# Altium project MotherBoard.PrjPcb (part 2 of 2)
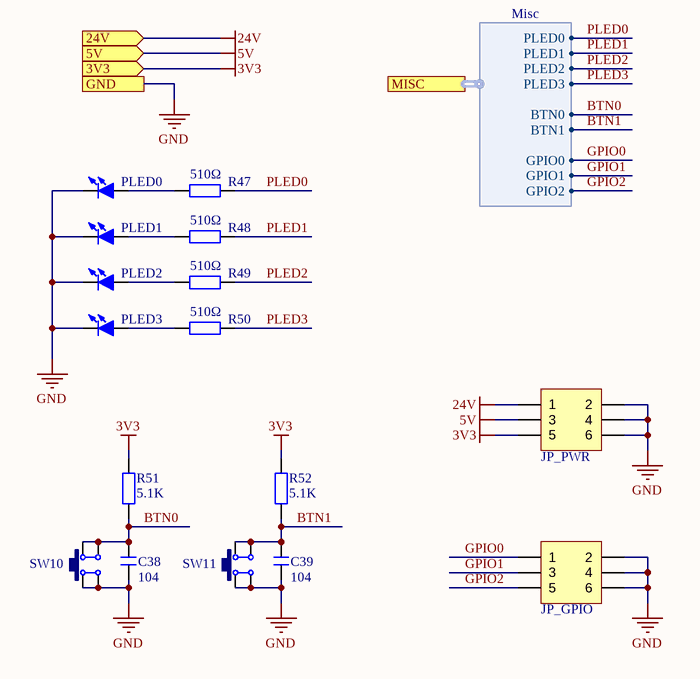
[diagram p16: Misc.SchDoc]

## Nets that join several sheets
3V3: 5V_and_3V3 (C8.1 V1.2), LowSpeedSlots_x8 (20 pins), HighSpeedSlots_x2 (6 pins), FPGA_Core (JTAG.2 R8.2 R9.2), PS_RJ45 (R12.2 R13.2), PL_PHY_RJ45 (15 pins), SD_Card (14 pins), LCD_Screen (R37.2 R38.2), Misc (JP_PWR.5 R51.2 R52.2)
5V: 5V_and_3V3 (5 pins), LowSpeedSlots_x8 (C40.2 U2.6 U2.16), HighSpeedSlots_x2 (C41.2 U5.5), FPGA_Core (8 pins), ADC_Array (7 pins), UART_TypeC (C28.2 C29.2 D5.1), LCD_Screen (C37.2 JP2.39 JP2.40), Misc (JP_PWR.3)
24V: 24V_Supply (5 pins), 5V_and_3V3 (C6.1 U1.1), U_LowSpeedSlots_x8/U_CardSlot1 (JP1_U_CardSlot1.1 JP1_U_CardSlot1.6 JP1_U_CardSlot1.16), U_LowSpeedSlots_x8/U_CardSlot2 (JP1_U_CardSlot2.1 JP1_U_CardSlot2.6 JP1_U_CardSlot2.16), U_LowSpeedSlots_x8/U_CardSlot3 (JP1_U_CardSlot3.1 JP1_U_CardSlot3.6 JP1_U_CardSlot3.16), U_LowSpeedSlots_x8/U_CardSlot4 (JP1_U_CardSlot4.1 JP1_U_CardSlot4.6 JP1_U_CardSlot4.16), U_LowSpeedSlots_x8/U_CardSlot5 (JP1_U_CardSlot5.1 JP1_U_CardSlot5.6 JP1_U_CardSlot5.16), U_LowSpeedSlots_x8/U_CardSlot6 (JP1_U_CardSlot6.1 JP1_U_CardSlot6.6 JP1_U_CardSlot6.16), U_LowSpeedSlots_x8/U_CardSlot7 (JP1_U_CardSlot7.1 JP1_U_CardSlot7.6 JP1_U_CardSlot7.16), U_LowSpeedSlots_x8/U_CardSlot8 (JP1_U_CardSlot8.1 JP1_U_CardSlot8.6 JP1_U_CardSlot8.16), U_HighSpeedSlots_x2/U_CardSlot9 (JP1_U_CardSlot9.1 JP1_U_CardSlot9.6 JP1_U_CardSlot9.16), U_HighSpeedSlots_x2/U_CardSlot10 (JP1_U_CardSlot10.1 JP1_U_CardSlot10.6 JP1_U_CardSlot10.16), Misc (JP_PWR.1)
GND: 24V_Supply (6 pins), 5V_and_3V3 (8 pins), LowSpeedSlots_x8 (18 pins), U_LowSpeedSlots_x8/U_CardSlot1 (6 pins), U_LowSpeedSlots_x8/U_CardSlot2 (6 pins), U_LowSpeedSlots_x8/U_CardSlot3 (6 pins), U_LowSpeedSlots_x8/U_CardSlot4 (6 pins), U_LowSpeedSlots_x8/U_CardSlot5 (6 pins), U_LowSpeedSlots_x8/U_CardSlot6 (6 pins), U_LowSpeedSlots_x8/U_CardSlot7 (6 pins), U_LowSpeedSlots_x8/U_CardSlot8 (6 pins), HighSpeedSlots_x2 (6 pins), U_HighSpeedSlots_x2/U_CardSlot9 (6 pins), U_HighSpeedSlots_x2/U_CardSlot10 (6 pins), FPGA_Core (29 pins), PS_RJ45 (8 pins), PL_PHY_RJ45 (27 pins), ADC_Array (58 pins), UART_TypeC (12 pins), SD_Card (12 pins), LCD_Screen (5 pins), Misc (16 pins)
AD_CLK: FPGA_Core (FPGA.J1_65), ADC_Array (R29.2 R32.2)
AD_CS0: FPGA_Core (FPGA.J1_66), ADC_Array (ADC1.1)
AD_CS1: FPGA_Core (FPGA.J1_68), ADC_Array (ADC2.1)
AD_MISO: FPGA_Core (FPGA.J1_63), ADC_Array (R30.2 R33.2)
AD_MOSI: FPGA_Core (FPGA.J1_61), ADC_Array (R31.2 R34.2)
BTN0: FPGA_Core (FPGA.J2_57), Misc (C38.2 R51.1 SW10.2 SW10.3)
BTN1: FPGA_Core (FPGA.J2_90), Misc (C39.2 R52.1 SW11.2 SW11.3)
GPIO0: FPGA_Core (FPGA.J1_47), Misc (JP_GPIO.1)
GPIO1: FPGA_Core (FPGA.J1_49), Misc (JP_GPIO.3)
GPIO2: FPGA_Core (FPGA.J1_51), Misc (JP_GPIO.5)
HAD0: U_HighSpeedSlots_x2/U_CardSlot9 (JP1_U_CardSlot9.8), U_HighSpeedSlots_x2/U_CardSlot10 (JP1_U_CardSlot10.8), FPGA_Core (FPGA.J1_86)
HAD1: U_HighSpeedSlots_x2/U_CardSlot9 (JP1_U_CardSlot9.9), U_HighSpeedSlots_x2/U_CardSlot10 (JP1_U_CardSlot10.9), FPGA_Core (FPGA.J1_84)
HAD2: U_HighSpeedSlots_x2/U_CardSlot9 (JP1_U_CardSlot9.10), U_HighSpeedSlots_x2/U_CardSlot10 (JP1_U_CardSlot10.10), FPGA_Core (FPGA.J1_82)
HAD3: HighSpeedSlots_x2 (U5.1), FPGA_Core (FPGA.J1_80)
HCLK: HighSpeedSlots_x2 (CHCLK.1), FPGA_Core (FPGA.J1_90)
HCTR: HighSpeedSlots_x2 (U5.3), FPGA_Core (FPGA.J1_74)
HDIN: HighSpeedSlots_x2 (CHDIN.1), FPGA_Core (FPGA.J1_88)
HEN9: HighSpeedSlots_x2 (U5.6), U_HighSpeedSlots_x2/U_CardSlot9 (JP1_U_CardSlot9.11)
HEN10: HighSpeedSlots_x2 (U5.4), U_HighSpeedSlots_x2/U_CardSlot10 (JP1_U_CardSlot10.11)
HSCLK9: HighSpeedSlots_x2 (CHCLK.3), U_HighSpeedSlots_x2/U_CardSlot9 (JP1_U_CardSlot9.3)
HSCLK10: HighSpeedSlots_x2 (CHCLK.8), U_HighSpeedSlots_x2/U_CardSlot10 (JP1_U_CardSlot10.3)
HSDIN9: HighSpeedSlots_x2 (CHDIN.3), U_HighSpeedSlots_x2/U_CardSlot9 (JP1_U_CardSlot9.4)
HSDIN10: HighSpeedSlots_x2 (CHDIN.8), U_HighSpeedSlots_x2/U_CardSlot10 (JP1_U_CardSlot10.4)
IIC_SCL: FPGA_Core (FPGA.J1_24), LCD_Screen (JP2.3 R38.1)
IIC_SDA: FPGA_Core (FPGA.J1_14), LCD_Screen (JP2.5 R37.1)
LAD0: U_LowSpeedSlots_x8/U_CardSlot1 (JP1_U_CardSlot1.8), U_LowSpeedSlots_x8/U_CardSlot2 (JP1_U_CardSlot2.8), U_LowSpeedSlots_x8/U_CardSlot3 (JP1_U_CardSlot3.8), U_LowSpeedSlots_x8/U_CardSlot4 (JP1_U_CardSlot4.8), U_LowSpeedSlots_x8/U_CardSlot5 (JP1_U_CardSlot5.8), U_LowSpeedSlots_x8/U_CardSlot6 (JP1_U_CardSlot6.8), U_LowSpeedSlots_x8/U_CardSlot7 (JP1_U_CardSlot7.8), U_LowSpeedSlots_x8/U_CardSlot8 (JP1_U_CardSlot8.8), FPGA_Core (FPGA.J1_73)
LAD1: U_LowSpeedSlots_x8/U_CardSlot1 (JP1_U_CardSlot1.9), U_LowSpeedSlots_x8/U_CardSlot2 (JP1_U_CardSlot2.9), U_LowSpeedSlots_x8/U_CardSlot3 (JP1_U_CardSlot3.9), U_LowSpeedSlots_x8/U_CardSlot4 (JP1_U_CardSlot4.9), U_LowSpeedSlots_x8/U_CardSlot5 (JP1_U_CardSlot5.9), U_LowSpeedSlots_x8/U_CardSlot6 (JP1_U_CardSlot6.9), U_LowSpeedSlots_x8/U_CardSlot7 (JP1_U_CardSlot7.9), U_LowSpeedSlots_x8/U_CardSlot8 (JP1_U_CardSlot8.9), FPGA_Core (FPGA.J1_75)
LAD2: U_LowSpeedSlots_x8/U_CardSlot1 (JP1_U_CardSlot1.10), U_LowSpeedSlots_x8/U_CardSlot2 (JP1_U_CardSlot2.10), U_LowSpeedSlots_x8/U_CardSlot3 (JP1_U_CardSlot3.10), U_LowSpeedSlots_x8/U_CardSlot4 (JP1_U_CardSlot4.10), U_LowSpeedSlots_x8/U_CardSlot5 (JP1_U_CardSlot5.10), U_LowSpeedSlots_x8/U_CardSlot6 (JP1_U_CardSlot6.10), U_LowSpeedSlots_x8/U_CardSlot7 (JP1_U_CardSlot7.10), U_LowSpeedSlots_x8/U_CardSlot8 (JP1_U_CardSlot8.10), FPGA_Core (FPGA.J1_77)
LAD3: LowSpeedSlots_x8 (U2.1), FPGA_Core (FPGA.J1_79)
LAD4: LowSpeedSlots_x8 (U2.2), FPGA_Core (FPGA.J1_81)
LAD5: LowSpeedSlots_x8 (U2.3), FPGA_Core (FPGA.J1_83)
LCD_B0: FPGA_Core (FPGA.J1_27), LCD_Screen (JP2.20)
LCD_B1: FPGA_Core (FPGA.J1_25), LCD_Screen (JP2.19)
LCD_B2: FPGA_Core (FPGA.J1_28), LCD_Screen (JP2.18)
LCD_B3: FPGA_Core (FPGA.J1_26), LCD_Screen (JP2.17)
LCD_B4: FPGA_Core (FPGA.J1_23), LCD_Screen (JP2.16)
LCD_B5: FPGA_Core (FPGA.J1_21), LCD_Screen (JP2.15)
LCD_B6: FPGA_Core (FPGA.J1_22), LCD_Screen (JP2.14)
LCD_B7: FPGA_Core (FPGA.J1_20), LCD_Screen (JP2.13)
LCD_BL: FPGA_Core (FPGA.J2_29), LCD_Screen (JP2.7)
LCD_CLK: FPGA_Core (FPGA.J1_18), LCD_Screen (JP2.11)
LCD_DE: FPGA_Core (FPGA.J1_11), LCD_Screen (JP2.8)
LCD_G0: FPGA_Core (FPGA.J1_35), LCD_Screen (JP2.29)
LCD_G1: FPGA_Core (FPGA.J1_33), LCD_Screen (JP2.28)
LCD_G2: FPGA_Core (FPGA.J1_38), LCD_Screen (JP2.27)
LCD_G3: FPGA_Core (FPGA.J1_36), LCD_Screen (JP2.26)
LCD_G4: FPGA_Core (FPGA.J1_31), LCD_Screen (JP2.25)
LCD_G5: FPGA_Core (FPGA.J1_29), LCD_Screen (JP2.24)
LCD_G6: FPGA_Core (FPGA.J1_32), LCD_Screen (JP2.23)
LCD_G7: FPGA_Core (FPGA.J1_30), LCD_Screen (JP2.22)
LCD_HSYNC: FPGA_Core (FPGA.J1_16), LCD_Screen (JP2.10)
LCD_R0: FPGA_Core (FPGA.J1_45), LCD_Screen (JP2.38)
LCD_R1: FPGA_Core (FPGA.J1_43), LCD_Screen (JP2.37)
LCD_R2: FPGA_Core (FPGA.J1_46), LCD_Screen (JP2.36)
LCD_R3: FPGA_Core (FPGA.J1_44), LCD_Screen (JP2.35)
LCD_R4: FPGA_Core (FPGA.J1_39), LCD_Screen (JP2.34)
LCD_R5: FPGA_Core (FPGA.J1_37), LCD_Screen (JP2.33)
LCD_R6: FPGA_Core (FPGA.J1_42), LCD_Screen (JP2.32)
LCD_R7: FPGA_Core (FPGA.J1_40), LCD_Screen (JP2.31)
LCD_RST: FPGA_Core (FPGA.J2_50), LCD_Screen (C36.1 JP2.1)
LCD_VSYNC: FPGA_Core (FPGA.J1_13), LCD_Screen (JP2.9)
LCLK: LowSpeedSlots_x8 (CFCLK1.1 CFCLK2.1), FPGA_Core (FPGA.J1_69)
LCTR: LowSpeedSlots_x8 (U2.4 U2.5), FPGA_Core (FPGA.J1_89)
LDIN: LowSpeedSlots_x8 (CFDIN1.1 CFDIN2.1), FPGA_Core (FPGA.J1_71)
LEN1: LowSpeedSlots_x8 (U2.15), U_LowSpeedSlots_x8/U_CardSlot1 (JP1_U_CardSlot1.11)
LEN2: LowSpeedSlots_x8 (U2.14), U_LowSpeedSlots_x8/U_CardSlot2 (JP1_U_CardSlot2.11)
LEN3: LowSpeedSlots_x8 (U2.13), U_LowSpeedSlots_x8/U_CardSlot3 (JP1_U_CardSlot3.11)
LEN4: LowSpeedSlots_x8 (U2.12), U_LowSpeedSlots_x8/U_CardSlot4 (JP1_U_CardSlot4.11)
LEN5: LowSpeedSlots_x8 (U2.11), U_LowSpeedSlots_x8/U_CardSlot5 (JP1_U_CardSlot5.11)
LEN6: LowSpeedSlots_x8 (U2.10), U_LowSpeedSlots_x8/U_CardSlot6 (JP1_U_CardSlot6.11)
LEN7: LowSpeedSlots_x8 (U2.9), U_LowSpeedSlots_x8/U_CardSlot7 (JP1_U_CardSlot7.11)
LEN8: LowSpeedSlots_x8 (U2.7), U_LowSpeedSlots_x8/U_CardSlot8 (JP1_U_CardSlot8.11)
LSCLK1: LowSpeedSlots_x8 (CFCLK1.14), U_LowSpeedSlots_x8/U_CardSlot1 (JP1_U_CardSlot1.3)
LSCLK2: LowSpeedSlots_x8 (CFCLK1.13), U_LowSpeedSlots_x8/U_CardSlot2 (JP1_U_CardSlot2.3)
LSCLK3: LowSpeedSlots_x8 (CFCLK1.11), U_LowSpeedSlots_x8/U_CardSlot3 (JP1_U_CardSlot3.3)
LSCLK4: LowSpeedSlots_x8 (CFCLK1.9), U_LowSpeedSlots_x8/U_CardSlot4 (JP1_U_CardSlot4.3)
LSCLK5: LowSpeedSlots_x8 (CFCLK2.14), U_LowSpeedSlots_x8/U_CardSlot5 (JP1_U_CardSlot5.3)
LSCLK6: LowSpeedSlots_x8 (CFCLK2.13), U_LowSpeedSlots_x8/U_CardSlot6 (JP1_U_CardSlot6.3)
LSCLK7: LowSpeedSlots_x8 (CFCLK2.11), U_LowSpeedSlots_x8/U_CardSlot7 (JP1_U_CardSlot7.3)
LSCLK8: LowSpeedSlots_x8 (CFCLK2.9), U_LowSpeedSlots_x8/U_CardSlot8 (JP1_U_CardSlot8.3)
LSDIN1: LowSpeedSlots_x8 (CFDIN1.14), U_LowSpeedSlots_x8/U_CardSlot1 (JP1_U_CardSlot1.4)
LSDIN2: LowSpeedSlots_x8 (CFDIN1.13), U_LowSpeedSlots_x8/U_CardSlot2 (JP1_U_CardSlot2.4)
LSDIN3: LowSpeedSlots_x8 (CFDIN1.11), U_LowSpeedSlots_x8/U_CardSlot3 (JP1_U_CardSlot3.4)
LSDIN4: LowSpeedSlots_x8 (CFDIN1.9), U_LowSpeedSlots_x8/U_CardSlot4 (JP1_U_CardSlot4.4)
LSDIN5: LowSpeedSlots_x8 (CFDIN2.14), U_LowSpeedSlots_x8/U_CardSlot5 (JP1_U_CardSlot5.4)
LSDIN6: LowSpeedSlots_x8 (CFDIN2.13), U_LowSpeedSlots_x8/U_CardSlot6 (JP1_U_CardSlot6.4)
LSDIN7: LowSpeedSlots_x8 (CFDIN2.11), U_LowSpeedSlots_x8/U_CardSlot7 (JP1_U_CardSlot7.4)
LSDIN8: LowSpeedSlots_x8 (CFDIN2.9), U_LowSpeedSlots_x8/U_CardSlot8 (JP1_U_CardSlot8.4)
PHY1_AD0: FPGA_Core (FPGA.J2_1), PS_RJ45 (RJ1.12)
PHY1_AD1: FPGA_Core (FPGA.J2_2), PS_RJ45 (RJ1.13)
PHY1_MDI0_N: FPGA_Core (FPGA.J2_5), PS_RJ45 (D3.2 D3.9 RJ1.3)
PHY1_MDI0_P: FPGA_Core (FPGA.J2_3), PS_RJ45 (D3.1 D3.10 RJ1.2)
PHY1_MDI1_N: FPGA_Core (FPGA.J2_9), PS_RJ45 (D3.5 D3.6 RJ1.5)
PHY1_MDI1_P: FPGA_Core (FPGA.J2_7), PS_RJ45 (D3.4 D3.7 RJ1.4)
PHY1_MDI2_N: FPGA_Core (FPGA.J2_6), PS_RJ45 (D4.2 D4.9 RJ1.7)
PHY1_MDI2_P: FPGA_Core (FPGA.J2_4), PS_RJ45 (D4.1 D4.10 RJ1.6)
PHY1_MDI3_N: FPGA_Core (FPGA.J2_10), PS_RJ45 (D4.5 D4.6 RJ1.9)
PHY1_MDI3_P: FPGA_Core (FPGA.J2_8), PS_RJ45 (D4.4 D4.7 RJ1.8)
PHY_MDC: FPGA_Core (FPGA.J2_16), PL_PHY_RJ45 (U3.30)
PHY_MDIO: FPGA_Core (FPGA.J2_14), PL_PHY_RJ45 (R17.2 U3.31)
PHY_RST_N: FPGA_Core (FPGA.J2_42), PL_PHY_RJ45 (R27.2)
PLED0: FPGA_Core (FPGA.J2_44), Misc (R47.2)
PLED1: FPGA_Core (FPGA.J2_55), Misc (R48.2)
PLED2: FPGA_Core (FPGA.J2_92), Misc (R49.2)
PLED3: FPGA_Core (FPGA.J2_95), Misc (R50.2)
RGMII_RXC: FPGA_Core (FPGA.J2_28), PL_PHY_RJ45 (U3.19)
RGMII_RXCTL: FPGA_Core (FPGA.J2_32), PL_PHY_RJ45 (R21.2 U3.13)
RGMII_RXD0: FPGA_Core (FPGA.J2_40), PL_PHY_RJ45 (R23.2 U3.14)
RGMII_RXD1: FPGA_Core (FPGA.J2_38), PL_PHY_RJ45 (R22.1 U3.16)
RGMII_RXD2: FPGA_Core (FPGA.J2_36), PL_PHY_RJ45 (R24.2 U3.17)
RGMII_RXD3: FPGA_Core (FPGA.J2_34), PL_PHY_RJ45 (R26.2 U3.18)
RGMII_TXC: FPGA_Core (FPGA.J2_24), PL_PHY_RJ45 (U3.22)
RGMII_TXCTL: FPGA_Core (FPGA.J2_26), PL_PHY_RJ45 (U3.27)
RGMII_TXD0: FPGA_Core (FPGA.J2_30), PL_PHY_RJ45 (U3.23)
RGMII_TXD1: FPGA_Core (FPGA.J2_22), PL_PHY_RJ45 (U3.24)
RGMII_TXD2: FPGA_Core (FPGA.J2_20), PL_PHY_RJ45 (U3.25)
RGMII_TXD3: FPGA_Core (FPGA.J2_18), PL_PHY_RJ45 (U3.26)
SD_CD: FPGA_Core (FPGA.J2_91), SD_Card (R45.1 R46.2)
SD_CLK: FPGA_Core (FPGA.J2_80), SD_Card (U7.9)
SD_CMD: FPGA_Core (FPGA.J2_78), SD_Card (U7.4)
SD_D0: FPGA_Core (FPGA.J2_82), SD_Card (U7.6)
SD_D1: FPGA_Core (FPGA.J2_84), SD_Card (U7.7)
SD_D2: FPGA_Core (FPGA.J2_86), SD_Card (U7.1)
SD_D3: FPGA_Core (FPGA.J2_88), SD_Card (U7.3)
T_CS: FPGA_Core (FPGA.J2_31), LCD_Screen (JP2.6)
T_MISO: FPGA_Core (FPGA.J1_12), LCD_Screen (JP2.4)
T_PEN: FPGA_Core (FPGA.J1_17), LCD_Screen (JP2.2)
UART1_RXD: FPGA_Core (FPGA.J2_89), UART_TypeC (U4.2)
UART1_TXD: FPGA_Core (FPGA.J2_87), UART_TypeC (U4.3)